# EAGLE design DeviceDigitalIn8 (EAGLE 5.00)
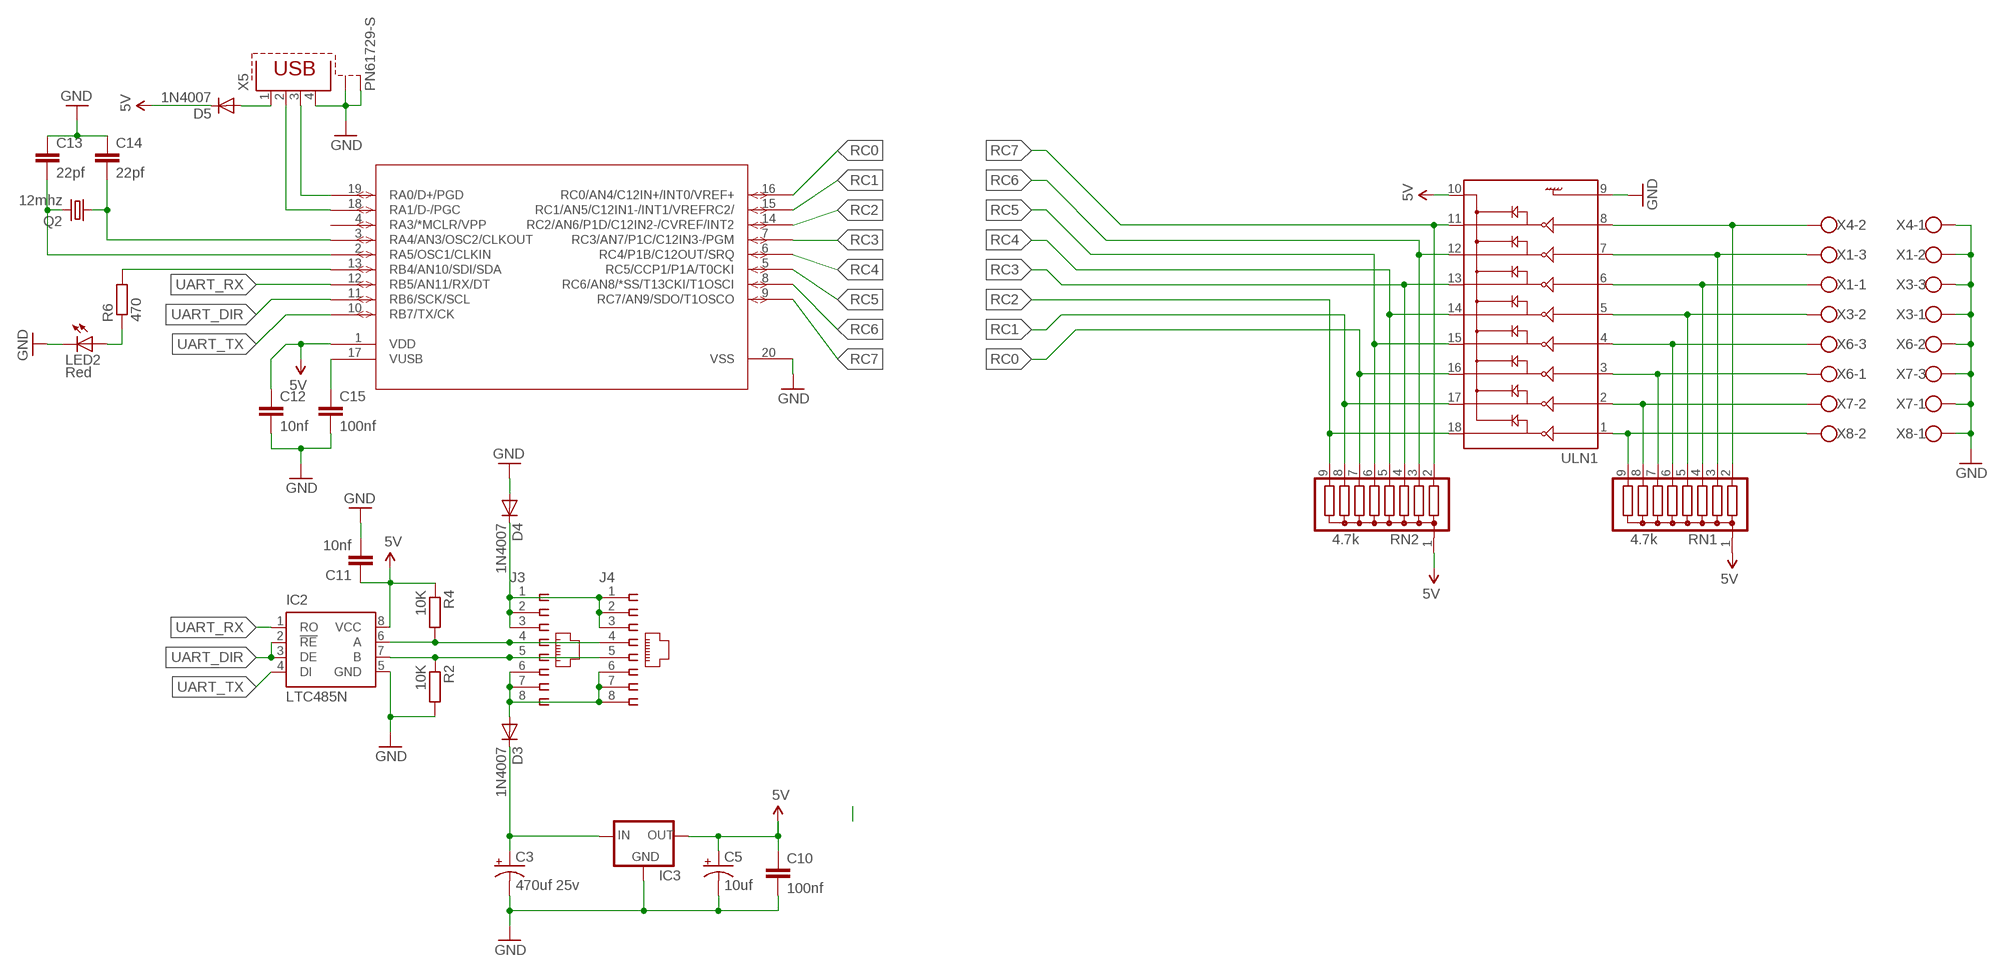
[diagram p0: schematic, sheet 1]

## Parts
C3  470uf 25v  CAP_POLPTH1  [CPOL-RADIAL-100UF-25V]
C5  10uf  CAP_POLPTH1  [CPOL-RADIAL-100UF-25V]
C10  100nf  C5/2.5  [C5B2.5]
C11  10nf  C5/2.5  [C5B2.5]
C12  10nf  C5/2.5  [C5B2.5]
C13  22pf  C5/2.5  [C5B2.5]
C14  22pf  C5/2.5  [C5B2.5]
C15  100nf  C7.5/3  [C7.5B3]
D3  1N4007  DIODE-D-7.5  [D-7.5]
D4  1N4007  DIODE-D-7.5  [D-7.5]
D5  1N4007  DIODE-D-7.5  [D-7.5]
IC2  LTC485N  [DIL08]
IC3  78XXL  [78XXL]
J3  215877-4  [215877-4]
J4  215877-4  [215877-4]
LED2  Red  LED5MM  [LED5MM]
Q2  12mhz  CRYSTALHC49U-V  [HC49U-V]
R2  10K  R-EU_0204/5  [0204/5]
R4  10K  R-EU_0204/5  [0204/5]
R6  470  R-EU_0207/10  [0207/10]
RN1  4.7k  G08R  [SIL9]
RN2  4.7k  G08R  [SIL9]
U$10  PIC18F14K50-E-P  [PIC18F14K50-E/P]
ULN1  ULN2803DIP  [DIL18]
X1  W237-103  [W237-103]
X3  W237-103  [W237-103]
X4  W237-102  [W237-102]
X5  PN61729-S  [PN61729-S]
X6  W237-103  [W237-103]
X7  W237-103  [W237-103]
X8  W237-102  [W237-102]

## Nets
5V: C5.1(+) C10.1 C11.1 C12.1 D5.C IC2.8(VCC) IC3.OUT R4.1 RN1.1 RN2.1 U$10.1(VDD) ULN1.10
GND: C3.2(-) C5.2(-) C10.2 C11.2 C12.2 C13.1 C14.1 C15.2 D4.A IC2.5(GND) IC3.GND LED2.K(C) R2.2 U$10.20(VSS) ULN1.9 X1.2 X3.1 X3.3 X4.1 X5.4 X5.S1 X5.S2 X6.2 X7.1 X7.3 X8.1
N$6: RN1.9 ULN1.1 X8.2
N$7: RN1.8 ULN1.2 X7.2
N$8: RN1.7 ULN1.3 X6.1
N$10: RN1.6 ULN1.4 X6.3
N$11: RN1.5 ULN1.5 X3.2
N$12: RN1.4 ULN1.6 X1.1
N$13: RN1.3 ULN1.7 X1.3
N$14: RN1.2 ULN1.8 X4.2
N$23: IC2.7(B) J3.5 J4.5 R2.1
N$24: C13.2 Q2.2 U$10.2(RA5/OSC1/CLKIN)
N$25: C14.2 Q2.1 U$10.3(RA4/AN3/OSC2/CLKOUT)
N$26: IC2.6(A) J3.4 J4.4 R4.2
N$27: D3.A J3.6 J3.7 J3.8 J4.6 J4.7 J4.8
N$28: C3.1(+) D3.C IC3.IN
N$29: D4.C J3.1 J3.2 J3.3 J4.1 J4.2 J4.3
N$30: R6.2 U$10.13(RB4/AN10/SDI/SDA)
N$31: LED2.A R6.1
N$32: U$10.19(RA0/D+/PGD) X5.3
N$33: U$10.18(RA1/D-/PGC) X5.2
N$34: D5.A X5.1
N$35: C15.1 U$10.17(VUSB)
RC0: RN2.7 U$10.16(RC0/AN4/C12IN+/INT0/VREF+) ULN1.16
RC1: RN2.8 U$10.15(RC1/AN5/C12IN1-/INT1/VREFRC2/) ULN1.17
RC2: RN2.9 U$10.14(RC2/AN6/P1D/C12IN2-/CVREF/INT2) ULN1.18
RC3: RN2.4 U$10.7(RC3/AN7/P1C/C12IN3-/PGM) ULN1.13
RC4: RN2.5 U$10.6(RC4/P1B/C12OUT/SRQ) ULN1.14
RC5: RN2.6 U$10.5(RC5/CCP1/P1A/T0CKI) ULN1.15
RC6: RN2.3 U$10.8(RC6/AN8/*SS/T13CKI/T1OSCI) ULN1.12
RC7: RN2.2 U$10.9(RC7/AN9/SDO/T1OSCO) ULN1.11
UART_DIR: IC2.2(!RE) IC2.3(DE) U$10.11(RB6/SCK/SCL)
UART_RX: IC2.1(RO) U$10.12(RB5/AN11/RX/DT)
UART_TX: IC2.4(DI) U$10.10(RB7/TX/CK)
Unconnected: U$10.4(RA3/*MCLR/VPP)

## Library data of the parts
C3 C5 = SparkFun:CAP_POL: Capacitor Polarized These are standard SMD and PTH capacitors. Normally 10uF, 47uF, and 100uF in electrolytic and tantalum varieties. Always verify the external diameter of the through hole cap, it varies with capacity, voltage, and manufacturer. The EIA devices should be standard.
C10-C15 = capacitor-wima:C: CAPACITOR naming: grid - package width
D3-D5 = diode:DIODE-: DIODE
IC2 = linear-technology:LTC485: Low Power RS485 Interface Transceiver Source: http://www.linear.com/pc/downloadDocument.do?navId=H0,C1,C1007,C1017,P2064,D1718
IC3 = v-reg:78XXL: VOLTAGE REGULATOR
J3 J4 = con-amp:215877-4: AMP connector
LED2 = led:LED: LED OSRAM: - CHIPLED LG R971, LG N971, LY N971, LG Q971, LY Q971, LO R971, LY R971 LH N974, LH R974 LS Q976, LO Q976, LY Q976 LO Q996 - Hyper CHIPLED LW Q18S LB Q993, LB Q99A, LB R99A - SideLED LS A670, LO A670, LY A670, LG A670, LP A670 LB A673, LV A673, LT A673, LW A673 LH A674 LY A675 LS A676, LA A676, LO A676, LY A676, LW A676 LS A679, LY A679, LG A679 - Hyper Micro SIDELED® LS Y876, LA Y876, LO Y876, LY Y876 LT Y87S - SmartLED LW L88C, LW L88S LB L89C, LB L89S, LG L890 LS L89K, LO L89K, LY L89K LS L896, LA L896, LO L896, LY L896 - TOPLED LS T670, LO T670, LY T670, LG T670, LP T670 LSG T670, LSP T670, LSY T670, LOP T670, LYG T670 LG T671, LOG T671, LSG T671 LB T673, LV T673, LT T673, LW T673 LH T674 LS T676, LA T676, LO T676, LY T676, LB T676, LH T676, LSB T676, LW T676 LB T67C, LV T67C, LT T67C, LS T67K, LO T67K, LY T67K, LW E67C LS E67B, LA E67B, LO E67B, LY E67B, LB E67C, LV E67C, LT E67C LW T67C LS T679, LY T679, LG T679 LS T770, LO T770, LY T770, LG T770, LP T770 LB T773, LV T773, LT T773, LW T773 LH T774 LS E675, LA E675, LY E675, LS T675 LS T776, LA T776, LO T776, LY T776, LB T776 LHGB T686 LT T68C, LB T68C - Hyper Mini TOPLED® LB M676 - Mini TOPLED Santana® LG M470 LS M47K, LO M47K, LY M47K Source: http://www.osram.convergy.de LUXEON: - LUMILED® LXK2-PW12-R00, LXK2-PW12-S00, LXK2-PW14-U00, LXK2-PW14-V00 LXK2-PM12-R00, LXK2-PM12-S00, LXK2-PM14-U00 LXK2-PE12-Q00, LXK2-PE12-R00, LXK2-PE12-S00, LXK2-PE14-T00, LXK2-PE14-U00 LXK2-PB12-K00, LXK2-PB12-L00, LXK2-PB12-M00, LXK2-PB14-N00, LXK2-PB14-P00, LXK2-PB14-Q00 LXK2-PR12-L00, LXK2-PR12-M00, LXK2-PR14-Q00, LXK2-PR14-R00 LXK2-PD12-Q00, LXK2-PD12-R00, LXK2-PD12-S00 LXK2-PH12-R00, LXK2-PH12-S00 LXK2-PL12-P00, LXK2-PL12-Q00, LXK2-PL12-R00 Source: www.luxeon.com KINGBRIGHT: KA-3528ASYC Source: www.kingbright.com
Q2 = crystal:CRYSTAL: CRYSTAL
R2 R4 R6 = resistor:R-EU_: RESISTOR, European symbol
RN1 RN2 = resistor-sil:G08R: SIL RESISTOR
U$10 = pic18f14k50:PIC18F14K50-E-P
ULN1 = SparkFun:ULN2803: Darlington Driver ULN2803 Darlington array. 500mA max per channel, 8-channel package. Spark Fun Electronics SKU : COM-00312
X1 X3 X6 X7 = con-wago-500:W237-103: WAGO SCREW CLAMP
X4 X8 = con-wago-500:W237-102: WAGO SCREW CLAMP
X5 = con-berg:PN61729-S: BERG USB connector

## Board
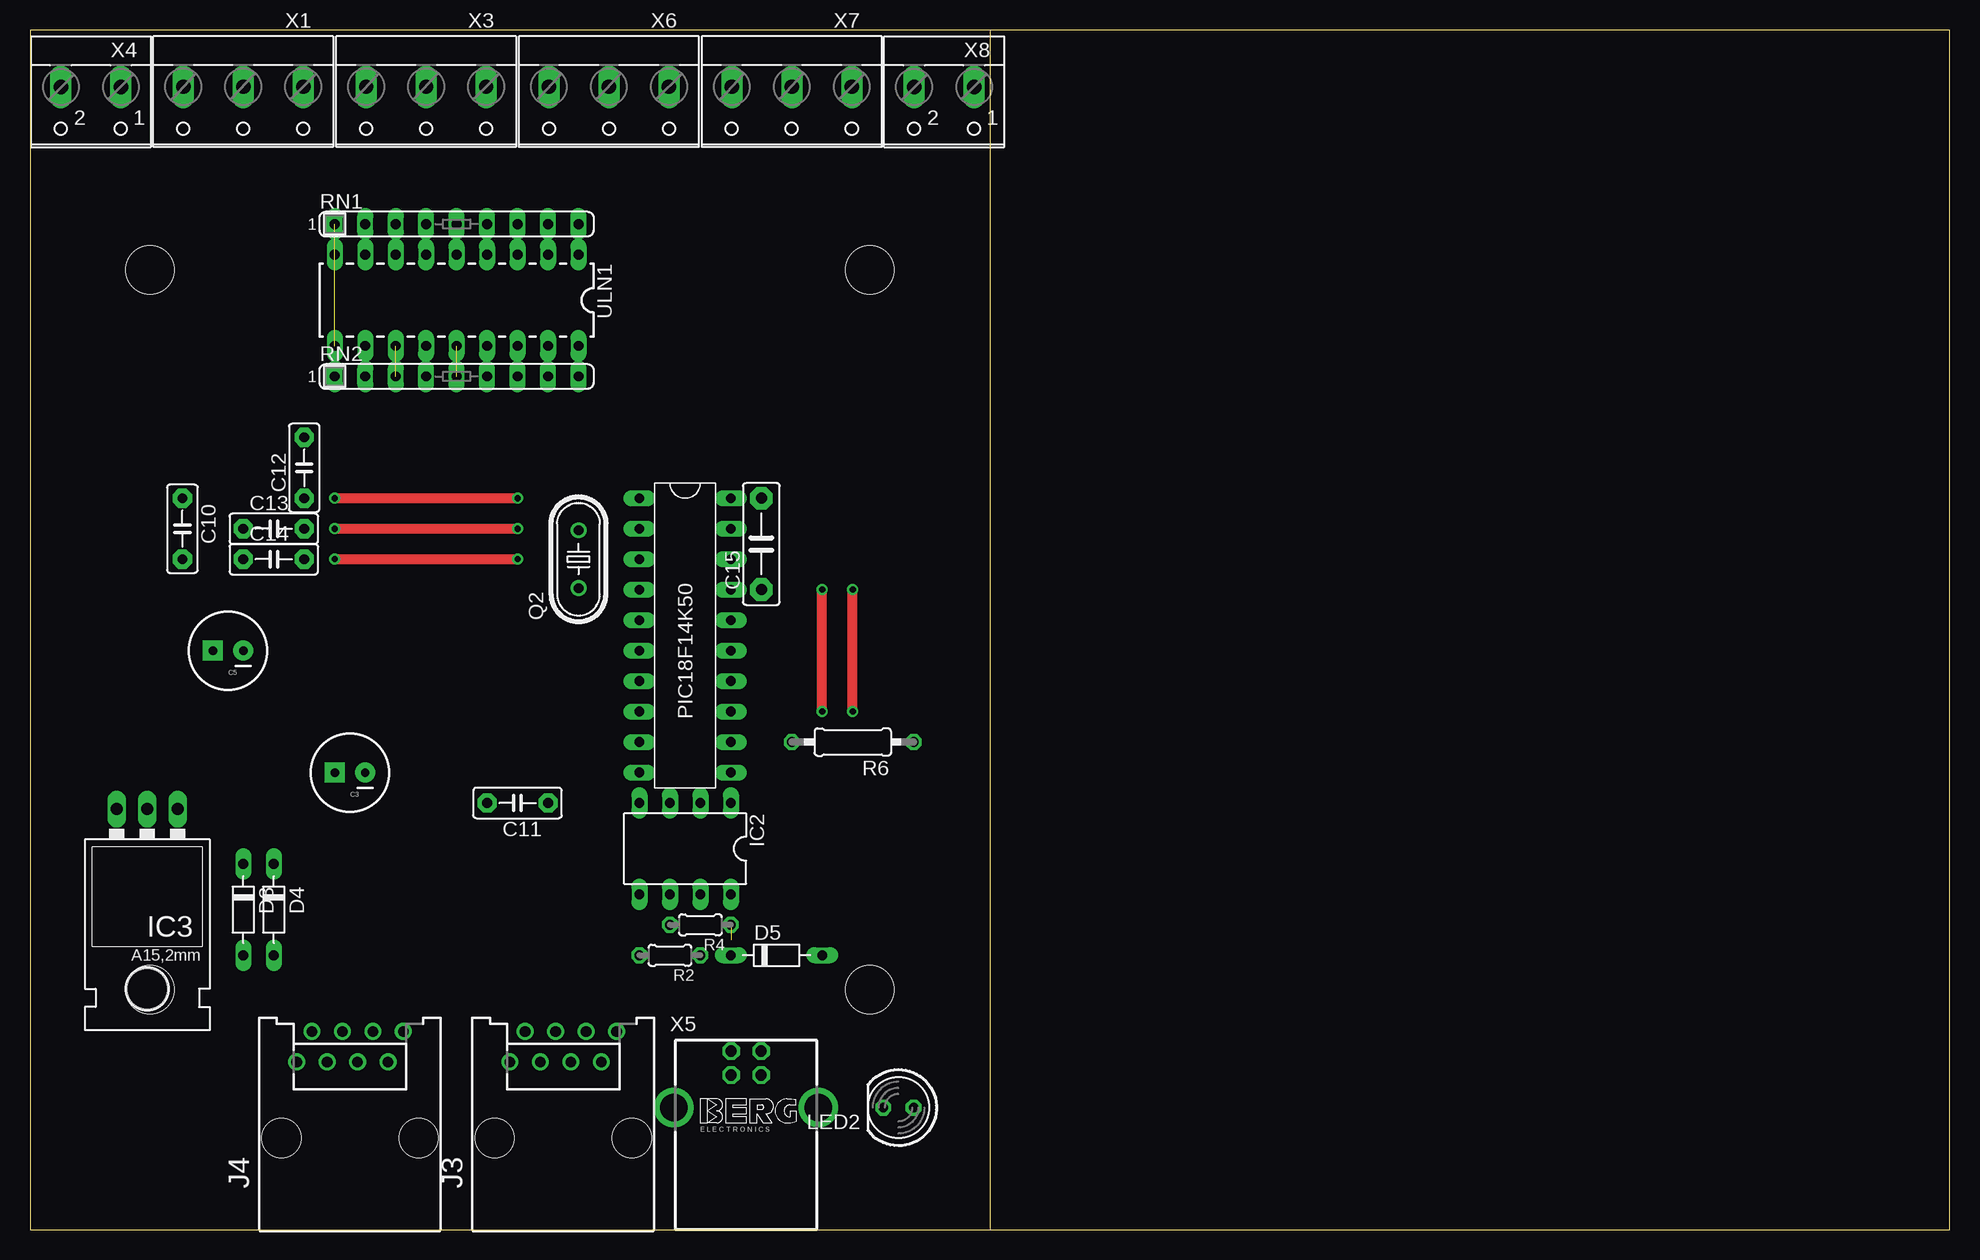
[diagram p1: board, top side]
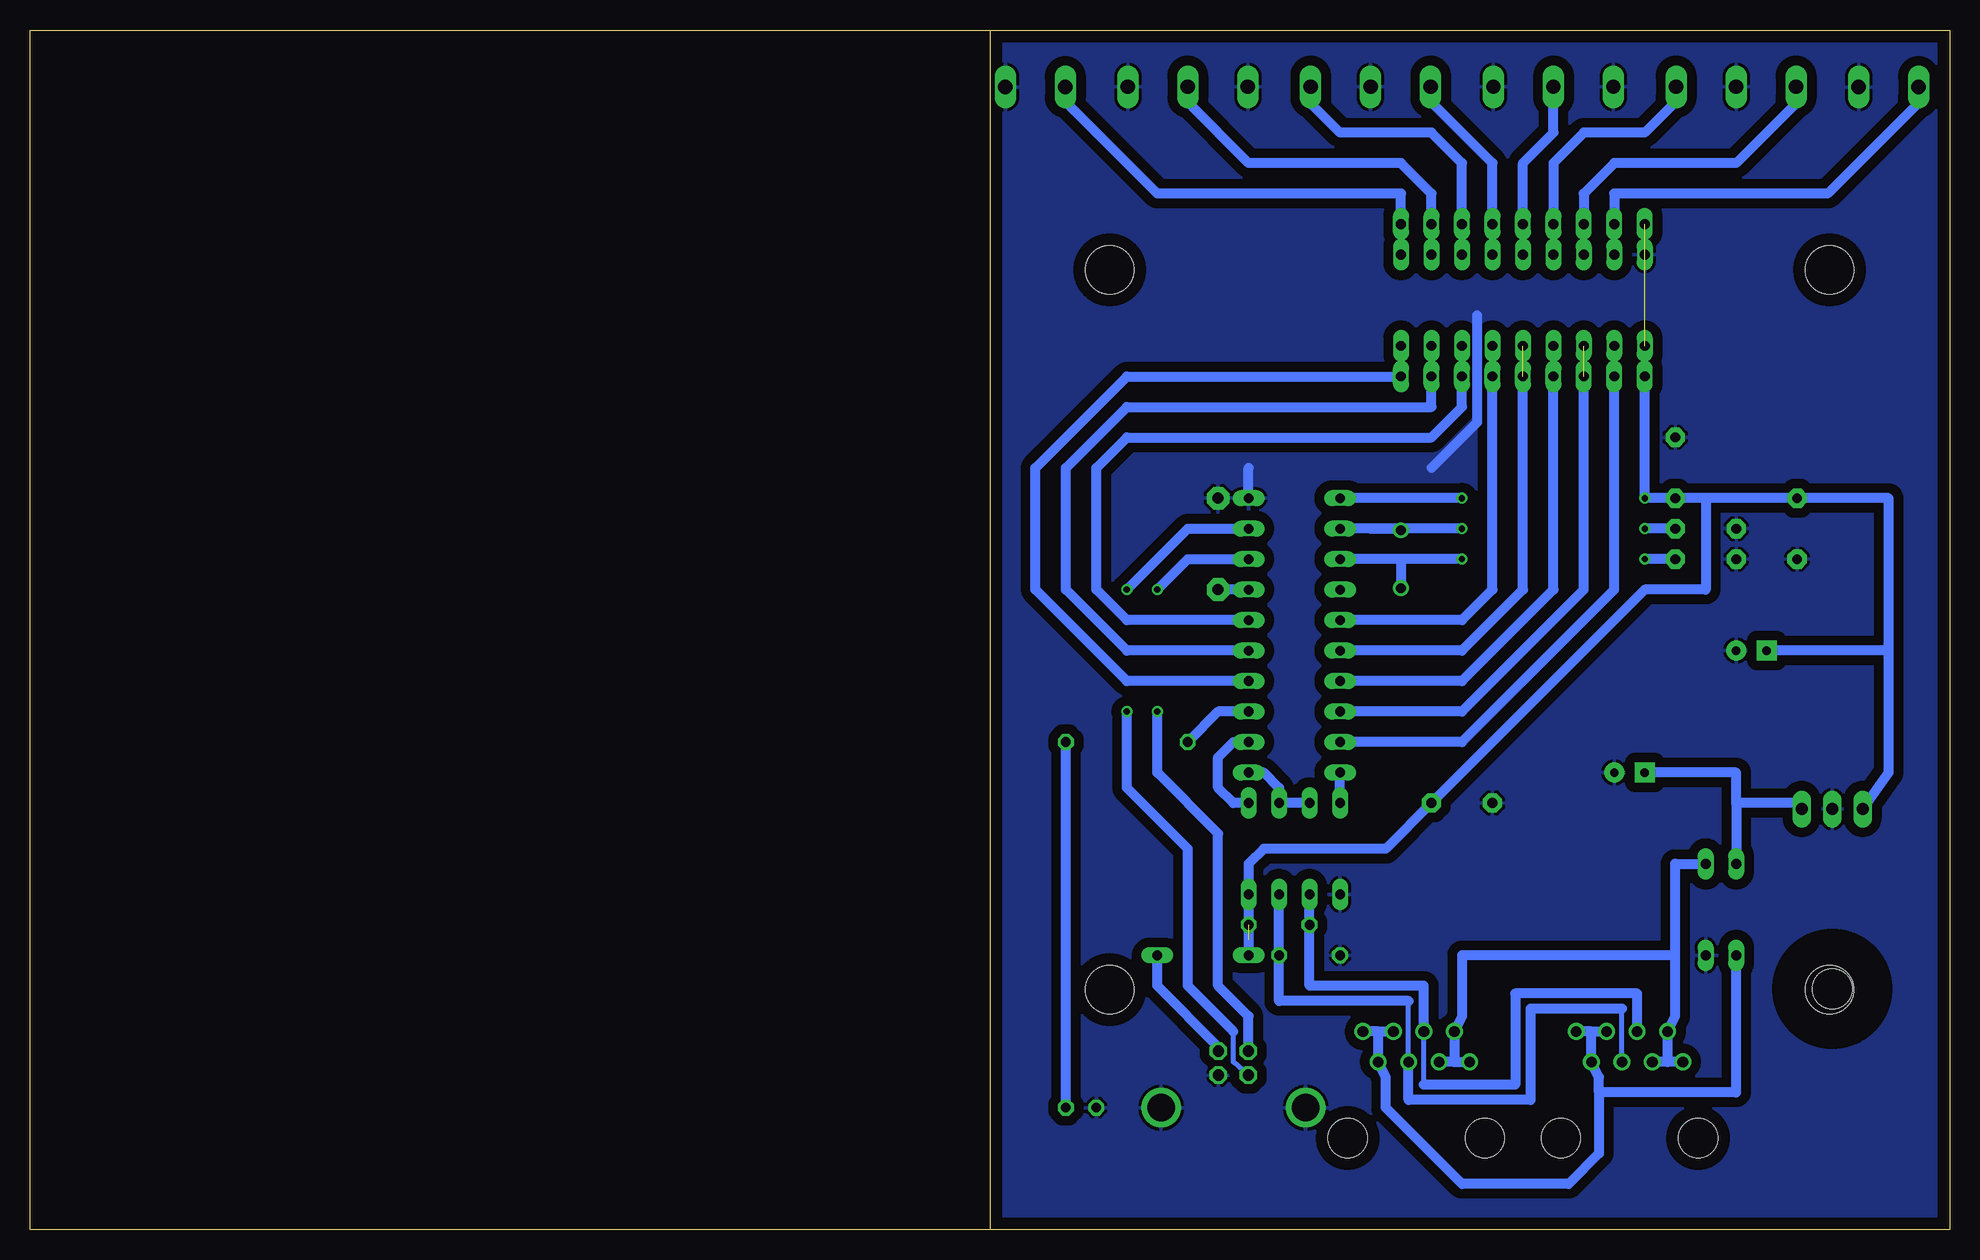
[diagram p2: board, bottom side, seen from below]

Size 160 x 100 mm. Coordinates in mm from the lower left corner, seen from the top.
Outline: 80,0 0,0 0,100 80,100
Outline: 80,0 160,0 160,100 80,100
Outline: 80,100 80,0
Copper layers (1*16): Top 0.035mm / dielectric 1.5mm / Bottom 0.035mm
Design rules "default": minimum track width 10mil, minimum drill 24mil, track to track 8mil, track to pad 8mil, pad to pad 8mil, via to via 8mil, smd to smd 8mil, copper to edge 40mil, drill to drill 8mil, minimum pad ring 10mil, minimum via ring 8mil, stop-mask expansion 4mil, vias tented up to drill 0mil, thermal gap 10mil
Holes 4 mm at 10,80 70,80 70,20 10,20

### Footprints (pad centres in the part's own frame; a part is rotated, then mirrored left to right if it is on the bottom)
CPOL-RADIAL-100UF-25V = drill 0.7 pad 1.651 square: 1 1.27,0 | drill 0.7 pad 1.651 round: 2 -1.27,0
C5B2.5 = drill 0.813 pad 1.6 octagon: 1 -2.54,0; 2 2.54,0
C7.5B3 = drill 0.914 pad 1.905 octagon: 1 -3.81,0; 2 3.81,0
D-7.5 = drill 0.813 long: A 3.81,0; C -3.81,0
DIL08 = drill 0.813 long: 1 -3.81,-3.81; 2 -1.27,-3.81; 3 1.27,-3.81; 4 3.81,-3.81; 5 3.81,3.81; 6 1.27,3.81; 7 -1.27,3.81; 8 -3.81,3.81
78XXL = drill 1.016 long: GND 0,-3.81; IN -2.54,-3.81; OUT 2.54,-3.81 | hole 3.302: 0,11.176
215877-4 = drill 0.889 round: 1 -4.445,6.35; 2 -3.175,8.89; 3 -1.905,6.35; 4 -0.635,8.89; 5 0.635,6.35; 6 1.905,8.89; 7 3.175,6.35; 8 4.445,8.89 | hole 3.251: -5.715,0; 5.715,0
LED5MM = drill 0.813 octagon: A -1.27,0; K 1.27,0
HC49U-V = drill 0.813 round: 1 -2.413,0; 2 2.413,0
0204/5 = drill 0.813 octagon: 1 -2.54,0; 2 2.54,0
0207/10 = drill 0.813 octagon: 1 -5.08,0; 2 5.08,0
SIL9 = drill 0.813 long: 1 -10.16,0; 2 -7.62,0; 3 -5.08,0; 4 -2.54,0; 5 0,0; 6 2.54,0; 7 5.08,0; 8 7.62,0; 9 10.16,0
PIC18F14K50-E/P = drill 0.813 long: 1 -5.08,12.7; 2 -5.08,10.16; 3 -5.08,7.62; 4 -5.08,5.08; 5 -5.08,2.54; 6 -5.08,0; 7 -5.08,-2.54; 8 -5.08,-5.08; 9 -5.08,-7.62; 10 -5.08,-10.16; 11 2.54,-10.16; 12 2.54,-7.62; 13 2.54,-5.08; 14 2.54,-2.54; 15 2.54,0; 16 2.54,2.54; 17 2.54,5.08; 18 2.54,7.62; 19 2.54,10.16; 20 2.54,12.7
DIL18 = drill 0.813 long: 1 -10.16,-3.81; 2 -7.62,-3.81; 3 -5.08,-3.81; 4 -2.54,-3.81; 5 0,-3.81; 6 2.54,-3.81; 7 5.08,-3.81; 8 7.62,-3.81; 9 10.16,-3.81; 10 10.16,3.81; 11 7.62,3.81; 12 5.08,3.81; 13 2.54,3.81; 14 0,3.81; 15 -2.54,3.81; 16 -5.08,3.81; 17 -7.62,3.81; 18 -10.16,3.81
W237-103 = drill 1.194 long: 1 -5,-1.29; 2 0,-1.29; 3 5,-1.29
W237-102 = drill 1.194 long: 1 -2.5,-1.27; 2 2.5,-1.27
PN61729-S = drill 0.95 octagon: 1 1.25,4.71; 2 -1.25,4.71; 3 -1.25,2.71; 4 1.25,2.71 | drill 2.3 pad 2.9 round: S1 -6.02,0; S2 6.02,0

### Placement (x,y rotation side)
C3  26.67,38.1 180 top
C5  16.51,48.26 180 top
C10  12.7,58.42 270 top
C11  40.64,35.56 180 top
C12  22.86,63.5 90 top
C13  20.32,58.42 0 top
C14  20.32,55.88 0 top
C15  60.96,57.15 90 top
D3  17.78,26.67 270 top
D4  20.32,26.67 270 top
D5  62.23,22.86 0 top
IC2  54.61,31.75 180 top
IC3  9.78,31.24 180 top
J3  44.45,7.62 0 top
J4  26.67,7.62 0 top
LED2  72.39,10.16 180 top
Q2  45.72,55.88 90 top
R2  53.34,22.86 180 top
R4  55.88,25.4 180 top
R6  68.58,40.64 180 top
RN1  35.56,83.82 0 top
RN2  35.56,71.12 0 top
U$10  55.88,48.26 0 top
ULN1  35.56,77.47 180 top
X1  17.78,93.98 180 top
X3  33.02,93.98 180 top
X4  5.08,93.98 180 top
X5  59.69,10.16 0 top
X6  48.26,93.98 180 top
X7  63.5,93.98 180 top
X8  76.2,93.98 180 top

### Tracks (layer width: path | path; a pad name or v marks a point on that pad's centre or on a via)
5V  (via drill 0.51)  (2 unrouted)
  Top 0.813: v25.4,60.96 v40.64,60.96
  Bottom 0.406: RN2.1 ULN1.10
  Bottom 0.813: D5.C 58.42,24.13 IC2.8 58.42,30.48 57.15,31.75 46.99,31.75 C11.1 25.4,53.34 20.32,53.34 20.32,60.96 | IC3.OUT 5.08,38.1 5.08,48.26 | v40.64,60.96 U$10.1 | RN2.1 v25.4,60.96 C12.1 20.32,60.96 | 5.08,48.26 C5.1 | 5.08,48.26 5.08,60.96 C10.1 20.32,60.96
GND
  Bottom 0.813: 39.37,76.2 39.37,67.31 43.18,63.5 | U$10.20 58.42,63.5
  pour Bottom (isolate 0.813): 80.01,100.33 80.01,0 0,0 0,100.33
N$6
  Bottom 0.406: ULN1.1 RN1.9
  Bottom 0.813: X8.2 73.66,93.98 66.04,86.36 45.72,86.36 RN1.9
N$7
  Bottom 0.406: ULN1.2 RN1.8
  Bottom 0.813: X7.2 63.5,93.98 58.42,88.9 45.72,88.9 43.18,86.36 RN1.8
N$8
  Bottom 0.406: ULN1.3 RN1.7
  Bottom 0.813: RN1.7 40.64,88.9 43.18,91.44 50.8,91.44 53.34,93.98 53.32,94 X6.1
N$10
  Bottom 0.406: ULN1.4 RN1.6
  Bottom 0.813: RN1.6 38.1,88.9 43.2,94 X6.3
N$11
  Bottom 0.406: ULN1.5 RN1.5
  Bottom 0.813: RN1.5 35.56,88.9 33.02,91.44 X3.2
N$12
  Bottom 0.406: RN1.4 ULN1.6
  Bottom 0.813: X1.1 22.84,94 25.4,91.44 30.48,91.44 33.02,88.9 RN1.4
N$13
  Bottom 0.406: RN1.3 ULN1.7
  Bottom 0.813: RN1.3 30.48,86.36 27.94,88.9 17.78,88.9 12.7,93.98 12.72,94 X1.3
N$14
  Bottom 0.406: RN1.2 ULN1.8
  Bottom 0.813: 2.58,93.94 X4.2 | 2.58,93.94 2.54,93.98 | 2.58,93.94 10.16,86.36 27.94,86.36 RN1.2
N$23
  Bottom 0.406: J3.5 45.09,19.05 | J4.5 27.3,18.41
  Bottom 0.813: IC2.7 R2.1 55.88,19.05 45.09,19.05 | J3.5 45.09,10.79 34.92,10.79 34.92,18.41 27.3,18.41
N$24  (via drill 0.51)
  Top 0.813: v25.4,58.42 v40.64,58.42
  Bottom 0.813: Q2.2 45.72,58.42 48.26,58.42 | 48.26,58.42 U$10.2 | v40.64,58.42 48.26,58.42 | C13.2 v25.4,58.42
N$25  (via drill 0.51)
  Top 0.813: v25.4,55.88 v40.64,55.88
  Bottom 0.813: 45.72,53.34 Q2.1 45.72,55.88 | 45.72,55.88 U$10.3 | v40.64,55.88 45.72,55.88 | C14.2 v25.4,55.88
N$26
  Bottom 0.406: 43.81,12.06 43.81,17.14
  Bottom 0.813: IC2.6 R4.2 53.34,20.32 43.81,20.32 43.81,17.14 J3.4 | 43.81,12.06 36.2,12.06 36.2,19.68 26.04,19.68 J4.4
N$27
  Bottom 0.813: 47.62,16.51 J3.8 | 29.84,16.51 J4.6 | 29.84,16.51 J4.8 | 29.84,16.51 J4.7 29.21,12.7 29.21,11.43 | 47.62,16.51 J3.6 | 47.62,16.51 J3.7 46.99,12.7 46.99,10.16 40.64,3.81 31.75,3.81 29.21,6.35 29.21,11.43 | D3.A 17.78,11.43 29.21,11.43
N$28
  Bottom 0.813: IC3.IN 12.7,35.56 17.78,35.56 | 17.78,35.56 17.78,38.1 C3.1 | 17.78,35.56 D3.C
N$29
  Bottom 0.813: 41.27,13.97 J3.3 | 23.5,13.97 J4.2 22.86,17.78 22.86,22.86 | 23.5,13.97 J4.3 | J4.1 23.5,13.97 | 41.27,13.97 J3.1 | 41.27,13.97 J3.2 40.64,17.78 40.64,22.86 22.86,22.86 | D4.C 22.86,30.48 22.86,22.86
N$30
  Bottom 0.813: U$10.13 60.96,43.18 R6.2
N$31
  Bottom 0.813: LED2.A R6.1
N$32  (via drill 0.51)
  Top 0.813: v68.58,43.18 v68.58,53.34
  Bottom 0.406: X5.3 59.69,13.97 59.69,16.51
  Bottom 0.813: v68.58,53.34 63.5,58.42 U$10.19 | v68.58,43.18 68.58,36.83 63.5,31.75 63.5,20.32 59.69,16.51
N$33  (via drill 0.51)
  Top 0.813: v66.04,43.18 v66.04,53.34
  Bottom 0.813: v66.04,53.34 63.5,55.88 U$10.18 | v66.04,43.18 66.04,38.1 60.96,33.02 60.96,20.32 58.42,17.78 X5.2
N$34
  Bottom 0.813: X5.1 60.96,15.24 66.04,20.32 D5.A
N$35
  Bottom 0.813: U$10.17 C15.1
RC0
  Bottom 0.406: RN2.7 ULN1.16
  Bottom 0.813: U$10.16 68.58,50.8 71.12,53.34 71.12,63.5 68.58,66.04 43.18,66.04 40.64,68.58 RN2.7
RC1
  Bottom 0.406: RN2.8 ULN1.17
  Bottom 0.813: RN2.8 43.18,68.58 68.58,68.58 73.66,63.5 73.66,53.34 68.58,48.26 U$10.15
RC2
  Bottom 0.406: RN2.9 ULN1.18
  Bottom 0.813: RN2.9 68.58,71.12 76.2,63.5 76.2,53.34 68.58,45.72 U$10.14
RC3
  Bottom 0.406: RN2.4 ULN1.13
  Bottom 0.813: RN2.4 33.02,53.34 40.64,45.72 U$10.7
RC4  (1 unrouted)
  Bottom 0.813: U$10.6 40.64,48.26 35.56,53.34 RN2.5
RC5
  Bottom 0.406: RN2.6 ULN1.15
  Bottom 0.813: RN2.6 38.1,53.34 40.64,50.8 U$10.5
RC6  (1 unrouted)
  Bottom 0.813: U$10.8 40.64,43.18 30.48,53.34 RN2.3
RC7
  Bottom 0.406: RN2.2 ULN1.11
  Bottom 0.813: RN2.2 27.94,53.34 40.64,40.64 U$10.9
UART_DIR
  Bottom 0.813: IC2.3 IC2.2 55.88,36.83 57.15,38.1 U$10.11
UART_RX
  Bottom 0.813: IC2.1 59.69,35.56 60.96,36.83 60.96,39.37 59.69,40.64 U$10.12
UART_TX
  Bottom 0.813: IC2.4 U$10.10
(copper drawn outside any net)
  shapes: Bottom circle x4